# Altium schematic sheet mainSchem.SchDoc
size Tabloid
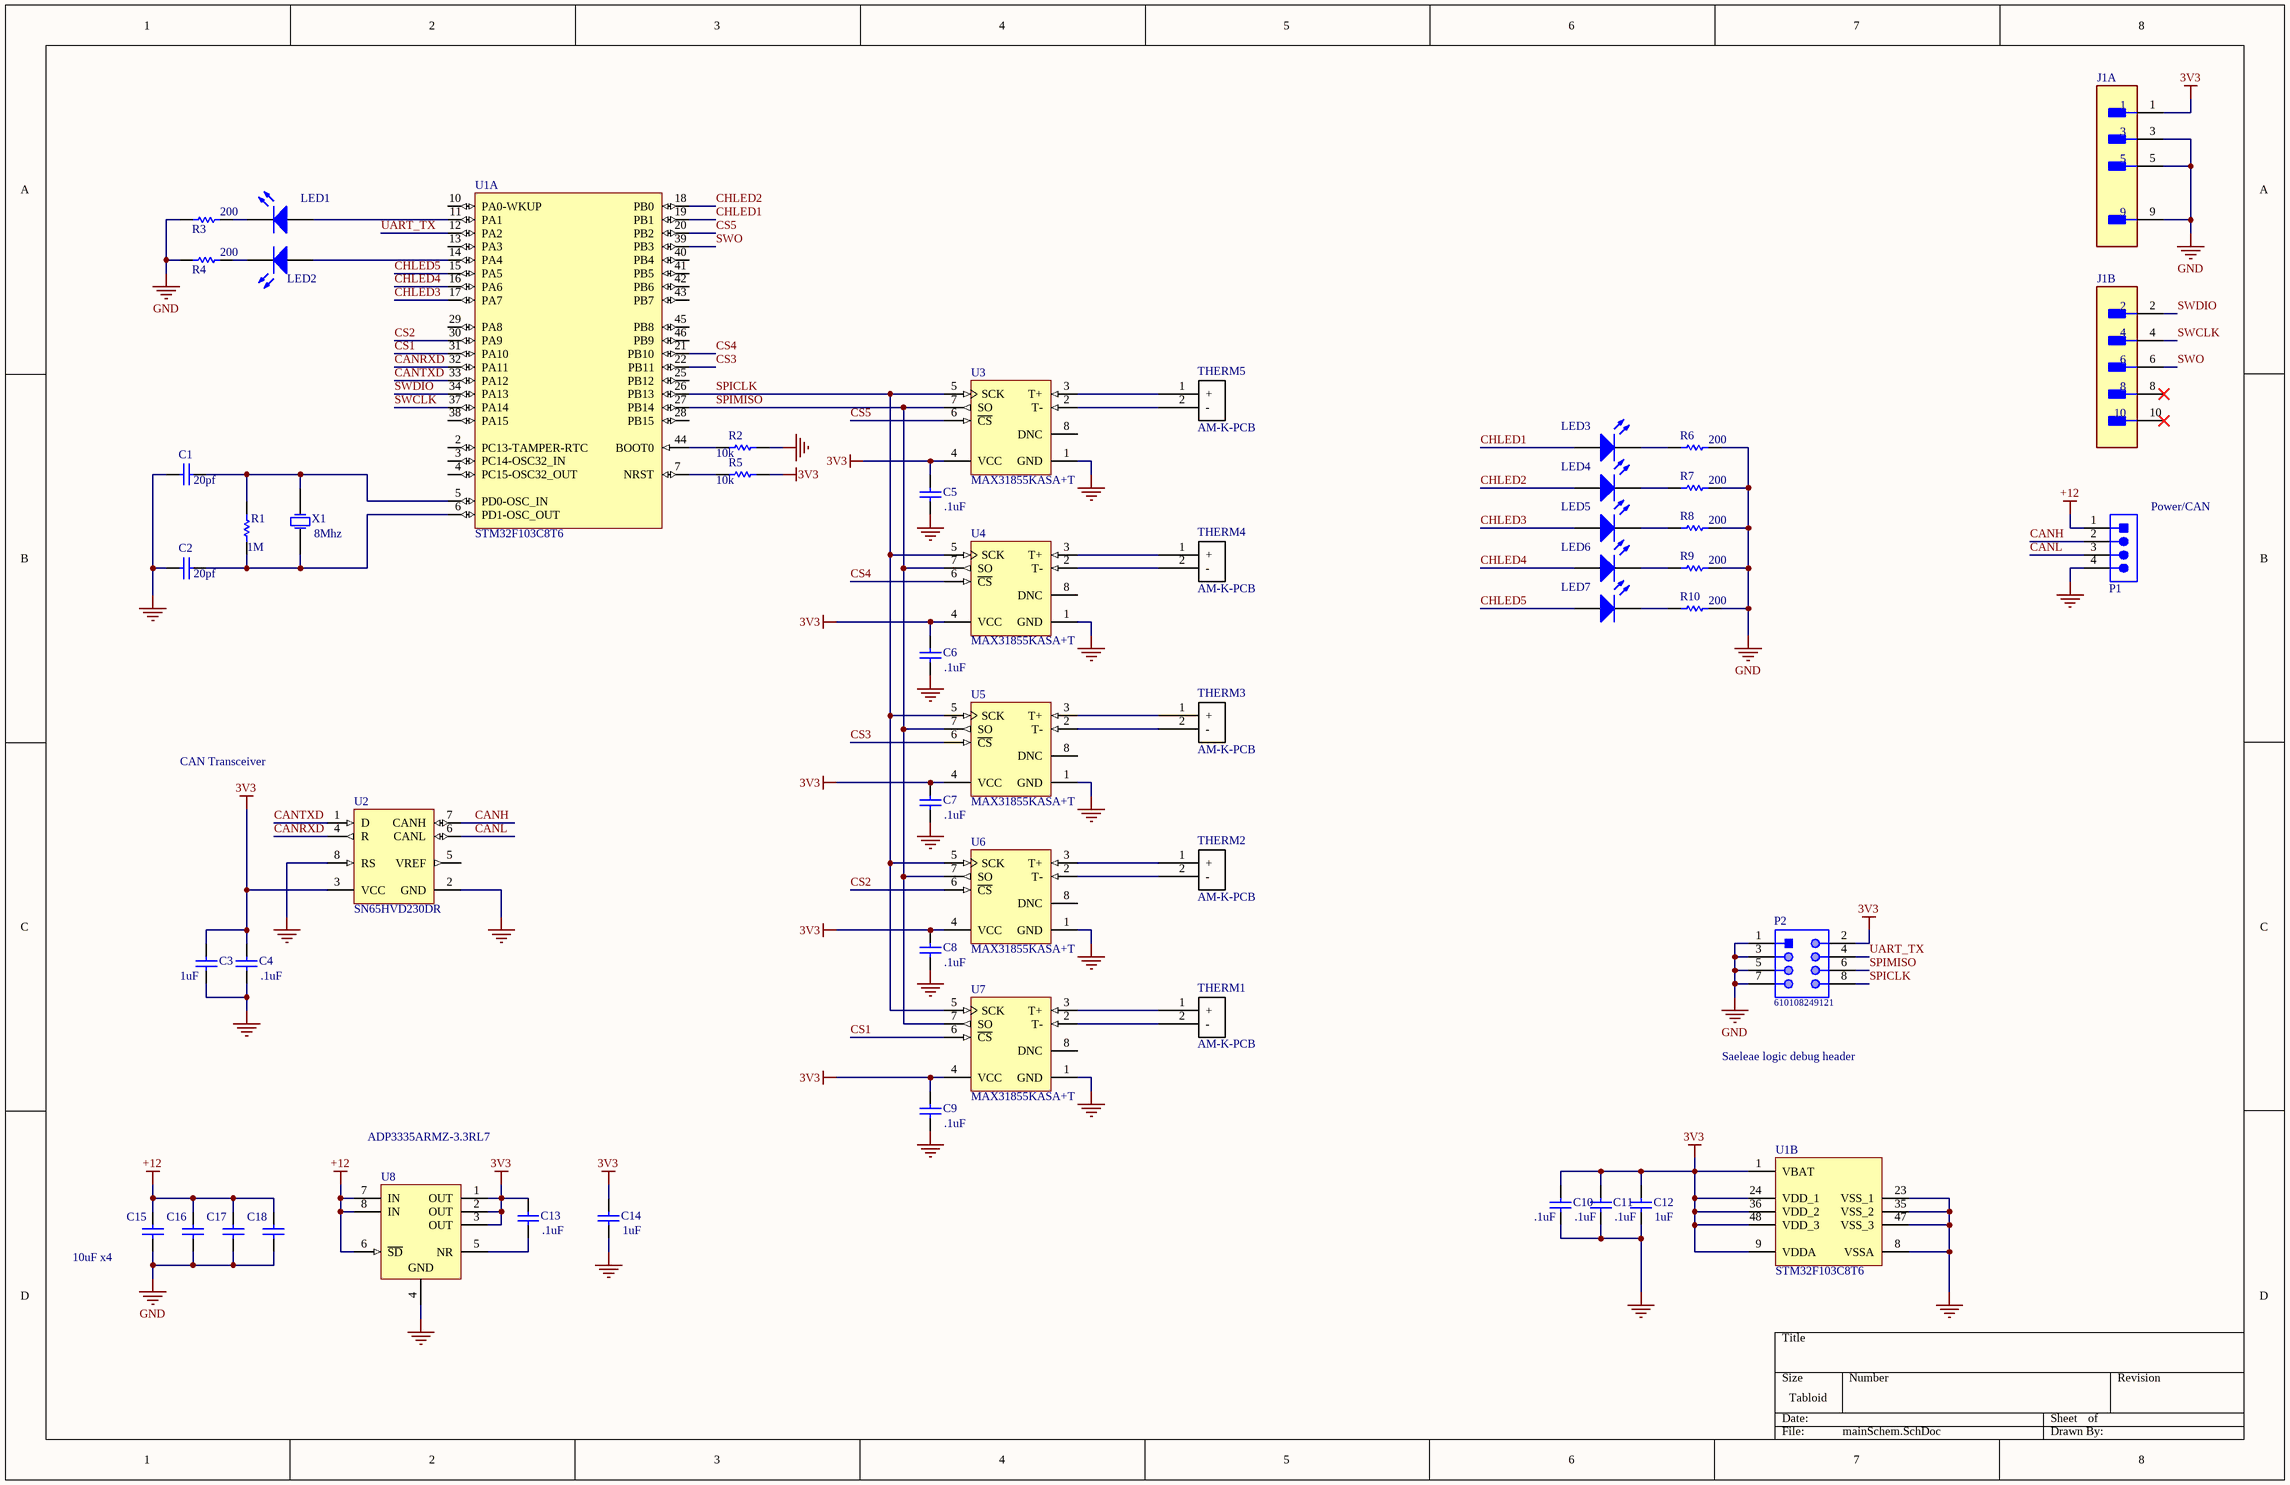
[diagram p0: mainSchem.SchDoc]

## Parts
C1  08051A200JAT2A  [CAPC2013X140X50NL20T25]  (value not drawn)
C2  08051A200JAT2A  [CAPC2013X140X50NL20T25]  (value not drawn)
C3  GRM31MR71H105KA88L  [CAPC3216X125X55LL15T25]  (value not drawn)
C4  12065C104KAT2A  [CAPC3216X94X50ML20T25]  (value not drawn)
C5  CGA3E2X7R1H104K080AA  [CAPC1608X90X20LL10]  (value not drawn)
C6  CGA3E2X7R1H104K080AA  [CAPC1608X90X20LL10]  (value not drawn)
C7  CGA3E2X7R1H104K080AA  [CAPC1608X90X20LL10]  (value not drawn)
C8  CGA3E2X7R1H104K080AA  [CAPC1608X90X20LL10]  (value not drawn)
C9  CGA3E2X7R1H104K080AA  [CAPC1608X90X20LL10]  (value not drawn)
C10  12065C104KAT2A  [CAPC3216X94X50ML20T25]  (value not drawn)
C11  12065C104KAT2A  [CAPC3216X94X50ML20T25]  (value not drawn)
C12  12065C104KAT2A  [CAPC3216X94X50ML20T25]  (value not drawn)
C13  CGA3E2X7R1H104K080AA  [CAPC1608X90X20LL10]  (value not drawn)
C14  GRM31MR71H105KA88L  [CAPC3216X125X55LL15T25]  (value not drawn)
C15  CGA5L3X5R1H106K160AB  [CAPC3216X190X20LL20]  (value not drawn)
C16  CGA5L3X5R1H106K160AB  [CAPC3216X190X20LL20]  (value not drawn)
C17  CGA5L3X5R1H106K160AB  [CAPC3216X190X20LL20]  (value not drawn)
C18  CGA5L3X5R1H106K160AB  [CAPC3216X190X20LL20]  (value not drawn)
J1  FTSH-105-01-L-DV-007-K  [FP-FTSH-105-01-L-DV-007-K-MFG]  (value not drawn)  (parts A,B of 2)
LED1  150120GS75000  [1206_A]  (value not drawn)
LED2  150120GS75000  [1206_A]  (value not drawn)
LED3  150120GS75000  [1206_A]  (value not drawn)
LED4  150120GS75000  [1206_A]  (value not drawn)
LED5  150120GS75000  [1206_A]  (value not drawn)
LED6  150120GS75000  [1206_A]  (value not drawn)
LED7  150120GS75000  [1206_A]  (value not drawn)
P1  B4B-PH-K-S(LF)(SN)  [JST-B4B-PH-K-S_V]  (value not drawn)
P2  610108249121  [610108249121]
R1  ERJ-8ENF1004V  [RESC3216X70X50NL05T20]  (value not drawn)
R2  ERJ3EKF1002V  [RESC1609X55X30LL15T15]  (value not drawn)
R3  CRCW1206200RFKEA  [RESC3216X60X45ML10T20]  (value not drawn)
R4  CRCW1206200RFKEA  [RESC3216X60X45ML10T20]  (value not drawn)
R5  ERJ3EKF1002V  [RESC1609X55X30LL15T15]  (value not drawn)
R6  CRCW0603200RFKEA  [RESC1609X50X30NL10T20]  (value not drawn)
R7  CRCW0603200RFKEA  [RESC1609X50X30NL10T20]  (value not drawn)
R8  CRCW0603200RFKEA  [RESC1609X50X30NL10T20]  (value not drawn)
R9  CRCW0603200RFKEA  [RESC1609X50X30NL10T20]  (value not drawn)
R10  CRCW0603200RFKEA  [RESC1609X50X30NL10T20]  (value not drawn)
THERM1  AM-K-PCB  [Type K Connector]
THERM2  AM-K-PCB  [Type K Connector]
THERM3  AM-K-PCB  [Type K Connector]
THERM4  AM-K-PCB  [Type K Connector]
THERM5  AM-K-PCB  [Type K Connector]
U1  STM32F103C8T6  [STM-LQFP48_L]  (parts A,B of 2)
U2  SN65HVD230DR  [D0008A_L]
U3  MAX31855KASA+T  [MAXM-S8+4_N]
U4  MAX31855KASA+T  [MAXM-S8+4_N]
U5  MAX31855KASA+T  [MAXM-S8+4_N]
U6  MAX31855KASA+T  [MAXM-S8+4_N]
U7  MAX31855KASA+T  [MAXM-S8+4_N]
U8  ADP3335ARMZ-3.3RL7  [ADI-RM-8_L]
X1  ABM3-8.000MHZ-D2Y-T  [ABRA-ABM3-2_V]  (value not drawn)

## Nets
3V3: C3.1 C4.1 C5.1 C6.1 C7.1 C8.1 C9.1 C10.1 C11.1 C12.1 C13.1 C14.1 J1.1 P2.2 R5.2 U1.1(VBAT) U1.9(VDDA) U1.24(VDD_1) U1.36(VDD_2) U1.48(VDD_3) U2.3(VCC) U3.4(VCC) U4.4(VCC) U5.4(VCC) U6.4(VCC) U7.4(VCC) U8.1(OUT) U8.2(OUT) U8.3(OUT)
+12: C15.1 C16.1 C17.1 C18.1 P1.1 U8.6(~{SD}) U8.7(IN) U8.8(IN)
GND: C1.1 C2.1 C3.2 C4.2 C5.2 C6.2 C7.2 C8.2 C9.2 C10.2 C11.2 C12.2 C14.2 C15.2 C16.2 C17.2 C18.2 J1.3 J1.5 J1.9 P1.4 P2.1 P2.3 P2.5 P2.7 R2.2 R3.1 R4.1 R6.2 R7.2 R8.2 R9.2 R10.2 U1.8(VSSA) U1.23(VSS_1) U1.35(VSS_2) U1.47(VSS_3) U2.2(GND) U2.8(RS) U3.1(GND) U4.1(GND) U5.1(GND) U6.1(GND) U7.1(GND) U8.4(GND)
CANH: P1.2 U2.7(CANH)
CANL: P1.3 U2.6(CANL)
CANRXD: U1.32(PA11) U2.4(R)
CANTXD: U1.33(PA12) U2.1(D)
CHLED1: LED3.2(A) U1.19(PB1)
CHLED2: LED4.2(A) U1.18(PB0)
CHLED3: LED5.2(A) U1.17(PA7)
CHLED4: LED6.2(A) U1.16(PA6)
CHLED5: LED7.2(A) U1.15(PA5)
CS1: U1.31(PA10) U7.6(~{CS})
CS2: U1.30(PA9) U6.6(~{CS})
CS3: U1.22(PB11) U5.6(~{CS})
CS4: U1.21(PB10) U4.6(~{CS})
CS5: U1.20(PB2) U3.6(~{CS})
SPICLK: P2.8 U1.26(PB13) U3.5(SCK) U4.5(SCK) U5.5(SCK) U6.5(SCK) U7.5(SCK)
SPIMISO: P2.6 U1.27(PB14) U3.7(SO) U4.7(SO) U5.7(SO) U6.7(SO) U7.7(SO)
SWCLK: J1.4 U1.37(PA14)
SWDIO: J1.2 U1.34(PA13)
SWO: J1.6 U1.39(PB3)
UART_TX: P2.4 U1.12(PA2)
NetC1_2: C1.2 R1.1 U1.5(PD0-OSC_IN) X1.1(X1)
NetC2_2: C2.2 R1.2 U1.6(PD1-OSC_OUT) X1.2(X2)
NetC13_2: C13.2 U8.5(NR)
NetLED1_1: LED1.1(K) R3.2
NetLED1_2: LED1.2(A) U1.11(PA1)
NetLED2_1: LED2.1(K) R4.2
NetLED2_2: LED2.2(A) U1.14(PA4)
NetLED3_1: LED3.1(K) R6.1
NetLED4_1: LED4.1(K) R7.1
NetLED5_1: LED5.1(K) R8.1
NetLED6_1: LED6.1(K) R9.1
NetLED7_1: LED7.1(K) R10.1
NetR2_1: R2.1 U1.44(BOOT0)
NetR5_1: R5.1 U1.7(NRST)
NetTHERM1_1: THERM1.1(+) U7.3(T+)
NetTHERM1_2: THERM1.2(-) U7.2(T-)
NetTHERM2_1: THERM2.1(+) U6.3(T+)
NetTHERM2_2: THERM2.2(-) U6.2(T-)
NetTHERM3_1: THERM3.1(+) U5.3(T+)
NetTHERM3_2: THERM3.2(-) U5.2(T-)
NetTHERM4_1: THERM4.1(+) U4.3(T+)
NetTHERM4_2: THERM4.2(-) U4.2(T-)
NetTHERM5_1: THERM5.1(+) U3.3(T+)
NetTHERM5_2: THERM5.2(-) U3.2(T-)

Not connected (* = marked no-connect by the designer): J1 8* 10*; U1 2(PC13-TAMPER-RTC) 3(PC14-OSC32_IN) 4(PC15-OSC32_OUT) 10(PA0-WKUP) 13(PA3) 25(PB12) 28(PB15) 29(PA8) 38(PA15) 40(PB4) 41(PB5) 42(PB6) 43(PB7) 45(PB8) 46(PB9); U2 5(VREF); U3 8(DNC); U4 8(DNC); U5 8(DNC); U6 8(DNC); U7 8(DNC)

## Notes on the sheet
- (near R3) 200
- (near R4) 200
- (near C1) 20pf
- (near R2) 10k
- (near R5) 10k
- (near R6) 200
- (near R7) 200
- (near R1) 1M
- (near X1) 8Mhz
- (near C5) .1uF
- (near R8) 200
- (near R9) 200
- (near P1) Power/CAN
- (near C2) 20pf
- (near R10) 200
- (near C6) .1uF
- CAN Transceiver
- (near C7) .1uF
- (near C8) .1uF
- (near C3) 1uF
- (near C4) .1uF
- Saeleae logic debug header
- (near C9) .1uF
- (near C13) .1uF
- (near C14) 1uF
- (near C10) .1uF
- (near C11) .1uF
- (near C12) .1uF
- (near C12) 1uF
- (near C15) 10uF x4

## Library data of the parts
C1 C2 = CMP-2007-04537-1: Manufacturer: AVX Interconnect / Elco; Part Number: 08051A200JAT2A
C3 C14 = CMP-2000-06356-1: Chip Capacitor, 1 uF, +/- 10%, 50 V, -55 to 125 degC, 1206 (3216 Metric), RoHS, Tape and Reel; Manufacturer: Murata; Case Width: 1.6mm; Dielectric: X7R; Case Length: 3.2mm; Case Height: 1.15mm; Voltage Rating DC: 50V; Capacitance: 1uF; Type: GeneralPurposeMLCC; Brand: MurataElectronics; Product: GeneralTypeMLCCs; Factory Pack Quantity: 3000; Packaging: Reel; Case Code - mm: 3216; Datasheet Version: 03/2016; Manufacturer URL: http://www.murata.com/; Tolerance: 10%; Case Code - in: 1206; Product Category: MultilayerCeramicCapacitorsMLCC-SMD/SMT; Series: GRM; Package Description: 2-Pin Surface Mount Device, Body 3.2 x 1.6 mm; Mounting Technology: SurfaceMount; Maximum Operating Temperature: +125C; RoHS: Details; Minimum Operating Temperature: -55C; Package Reference: 1206; Datasheet URL: http://search.murata.co.jp/Ceramy/image/img/A01X/G101/ENG/GRM31MR71H105KA88-01.pdf; Package / Case: 1206(3216metric); Termination Style: SMD/SMT
C4 C10-C12 = CMP-2000-05018-1: Chip Capacitor, Ceramic, 100 nF, 10%, 50 V, 1206, RoHS, Tape and Reel; Manufacturer: AVX; Rated Voltage: 50V; Dielectric: X7R; Capacitance: 100nF; Datasheet URL: http://www.mouser.com/ds/2/40/cauto-360.pdf; Manufacturer URL: http://www.avx.com/; Datasheet Version: Sep-14; Tolerance (%): ±10%; Case Size/Dimension: 1206
C5-C9 C13 = CMP-2000-07546-1: Chip Capacitor, 0.1 uF, +/- 10%, 50 V, -55 to 125 degC, 0603 (1608 Metric), RoHS, Tape and Reel; Manufacturer: TDK; Capacitance: 100nF; Voltage: 50V; Dielectric: X7R; Package Reference: 603; Radiation Hardening: No; Composition: Ceramic; Datasheet URL: https://product.tdk.com/info/en/catalog/datasheets/mlcc_automotive_general_en.pdf; Mounting Technology: SurfaceMount; Datasheet Version: 12/2014; Width: 0.8mm; Length: 1.6mm; Tolerance: 10%; Case Code (Imperial): 0603; RoHSCompliant: True; Min Operating Temperature: -55degC; Package Description: 2-Pin Surface Mount Device, Body 1.6 x 0.8 mm; Packaging: TapeandReel; Package Quantity: 1; Voltage Rating: 50V; Mount: SurfaceMount; Lead Free: LeadFree; Depth: 0.8mm; Termination: SMD/SMT; Case Code (Metric): 1608; Thickness: 0.035inch; Height: 0.8mm; Weight: 7.1E-05oz; Voltage Rating (DC): 50V; REACH SVHC: NoSVHC; Manufacturer URL: http://www.tdk.com/; Case/Package: 0603; Max Operating Temperature: 125degC
C15-C18 = CMP-2000-07597-1: Chip Capacitor, 10 uF, +/- 10%, 50 V, -55 to 85 degC, 1206 (3216 Metric), RoHS, Tape and Reel; Manufacturer: TDK; Dielectric: X5R; Voltage Rating: 50V; Capacitance: 10uF; Width: 1.6mm; Termination: SMD/SMT; Depth: 1.6mm; Package Reference: 1206; Package Quantity: 1; Lead Free: LeadFree; Max Operating Temperature: 85degC; Weight: 0.000571oz; Mounting Technology: SurfaceMount; Case Code (Imperial): 1206; Thickness: 0.063inch; Voltage Rating (DC): 50V; Case Code (Metric): 3216; RoHSCompliant: True; Packaging: TapeandReel; REACH SVHC: NoSVHC; Case/Package: 1206; Min Operating Temperature: -55degC; Manufacturer URL: http://www.tdk.com/; Datasheet Version: 01/2016; Length: 3.2mm; Radiation Hardening: No; Height: 1.6mm; Tolerance: 10%; Composition: Ceramic; Datasheet URL: https://product.tdk.com/info/en/documents/chara_sheet/CGA5L3X5R1H106K160AB.pdf; Package Description: 2-Pin Surface Mount Device, Body 3.2 x 1.6 mm; Mount: SurfaceMount
J1 = CMP-02766-000093-1: CONN HEADER SMD 10POS 1.27MM; Manufacturer: Samtec; Number Of Contacts: 9; Standoff Height: 0.2mm; Current Rating: 3.4A; Conn Orientation: Vertical; Conn Gender: Male; Device Class L3: unset; Manufacturer Part Number: FTSH-105-01-L-DV-007-K; Mouser Description: Conn Unshrouded Header HDR 10 POS 1.27mm Solder ST SMD Tube; Height: 6.38mm; RoHS: TRUE; Number Of Rows: 2; Footprint Url: http://suddendocs.samtec.com/prints/ftsh-1xx-xx-xxx-dv-xxx-footprint.pdf; Lead Free: Yes; Package: 0; Category: Conn; ComponentLink2URL: http://suddendocs.samtec.com/catalog_english/ftsh_smt.pdf; Automotive: No; ComponentLink2Description: Datasheet; Device Class L1: Connectors; Temperature: -55°C to +125°C; Digikey Description: CONN HEADER SMD 10POS 1.27MM; Device Class L2: Headers and Wire Housings; Temperature Range High: +125°C; Octopart: https://octopart.com/ftsh-105-01-l-dv-007-k-samtec-53647300; Contact Material: Gold,Nickel; Temperature Range Low: -55°C; Pitch: 1.27mm
LED1-LED7 = CMP-1426-00014-1: SMD mono-color Chip LED, WL-SMCW, Green; Manufacturer: Wuerth Elektronik; PackageReference: 1206_A; PartNumber: 150120GS75000; ComponentLink1Description: Manufacturer URL; ComponentLink2URL: http://katalog.we-online.com/led/datasheet/150120GS75000.pdf; ComponentLink2Description: Datasheet; Color: Green; ComponentLink1URL: http://www.we-online.com
P1 = CMP-2000-05165-1: Male Header, Pitch 2 mm, 1 x 4 Position, Height 6 mm, Tail Length 3.4 mm, -25 to 85 degC, RoHS, Bulk; Manufacturer: JST; No of Positions: 4; Style/Orientation: StraightHeader/Plug; Pitch: 2mm; Datasheet URL: http://datasheet.octopart.com/B4B-PH-K-S%28LF%29%28SN%29-JST-datasheet-10558886.pdf; Type: ShroudedHeader; Manufacturer URL: http://www.jst.com/home2.html; Termination: Crimp; Datasheet Version: Apr-09
P2 = CMP-1502-01147-1: SMT Angled Pin Header WR-PHD, Pitch 2.54 mm, Dual Row, 8 pins; Manufacturer: Wurth Elektronik; Pitch: 2.54mm; Working Voltage: 250VAC; Rated Current: 3A; Pin Number: 8; Gender: Male; Contact Resistance: 20mOhm; Withstanding Voltage: 600VAC; Row Number: Dual; Operating Temperature: -40to105degC; Part Number: 610108249121; Publisher: WurthElektronik; Datasheet URL: https://katalog.we-online.de/em/datasheet/6101xx249121.pdf; Package Reference: 610108249121; Manufacturer URL: http://www.we-online.de; Orientation: Angled; Mounting Technology: SMT; Packaging: TapeandReel
R1 = CMP-2003-00020-1: Manufacturer: Panasonic; Part Number: ERJ-8ENF1004V
R2 R5 = CMP-2000-07452-1: Chip Resistor, 10 KOhm, +/- 1%, 0.1 W, -55 to 155 degC, 0603 (1608 Metric), RoHS, Tape and Reel; Manufacturer: Panasonic; Voltage Rating: 75V; Case\/Package: 0603; Power Rating: 100mW; Resistance: 10KOhm; Temperature Coefficient: 100ppm\/degreesC; Number of Pins: 2; Package Reference: 603; Depth: 0.8mm; Mount: SurfaceMount; Package Description: 2-Pin Surface Mount Device, Body 1.6 x 0.85 mm; Datasheet Version: 02/2017; Length: 1.6mm; Lead Free: LeadFree; Height: 0.45mm; Number of Terminations: 2; Max Power Dissipation: 100mW; Min Operating Temperature: -55degC; Datasheet URL: https://industrial.panasonic.com/cdbs/www-data/pdf/RDA0000/AOA0000C304.pdf; Termination: SMD/SMT; Case Code (Metric): 1608; Case Code (Imperial): 0603; Tolerance: 1%; Max Operating Temperature: 155degC; RoHSCompliant: true; Voltage Rating (DC): 75V; Radiation Hardening: No; Packaging: TapeandReel; Composition: ThickFilm; Mounting Technology: SurfaceMount; Manufacturer URL: http://www.panasonic.com/; Width: 0.031inch; REACH SVHC: NoSVHC; Contact Plating: Tin; Military Standard: Not; Package Quantity: 1
R3 R4 = CMP-2003-01935-1: Manufacturer: Vishay Dale; Part Number: CRCW1206200RFKEA
R6-R10 = CMP-2000-03062-1: Manufacturer: Vishay Dale; Part Number: CRCW0603200RFKEA
THERM1-THERM5 = Type K Thermocoulple Conn.
U1 = CMP-0237-00215-3: ARM Cortex-M3 32-bit MCU, 64 KB Flash, 20 KB Internal RAM, 37 I/Os, 48-pin LQFP, -40 to 85 degC, Tray; Supply Voltage(Vcc) min (V): 2; Internal RAM Size (kB): 20; FLASH Size (Prog) (kB): 64; A/D Converter: 2x12-bit (10 Channel); I/Os (High Current): 37; Operating Frequency(F) (Processor speed) (MHz): 72; Core: ARM Cortex-M3; ComponentLink3Description: Package Specification; Mounting Technology: Surface Mount; PartNumber: STM32F103C8T6; PackageReference: LQFP48; Packing: Tray; ComponentLink3URL: http://www.st.com/st-web-ui/static/active/en/resource/technical/document/datasheet/DM00058181.pdf; DatasheetVersion: Rev. 16; ComponentLink1URL: http://www.st.com/web/en/home.html; PackageVersion: Rev. 6, 06/2013; ComponentLink2URL: http://www.st.com/st-web-ui/static/active/en/resource/technical/document/datasheet/CD00161566.pdf; ComponentLink1Description: Manufacturer URL; ComponentLink2Description: Datasheet; PackageDescription: 48-Pin Low Profile Quad Flat Package, 7 x 7 mm Body, 0.5 mm Pitch
U2 = CMP-0315-00015-2: 3.3V CAN Transceiver with Standby Mode, 17 mA, -40 to 85 degC, 8-pin SOIC (D), Green (RoHS & no Sb/Br); Manufacturer: Texas Instruments; Rating: Catalog; Transient Pulse Protection(V): -25 to 25; Receivers Per Package: 1; ICC(Max)(mA): 17; Supply Voltage(s)(V): 3.3; Low Power Mode: Standby; Mounting Technology: Surface Mount; PackageReference: D0008A; Footprint: PCA82C250; ComponentLink1URL: http://www.ti.com/general/docs/lit/getliterature.tsp?genericPartNumber=SN65HVD230&fileType=pdf; Code_JEDEC: MS-012AA; ComponentLink1Description: Datasheet; Eco-Plan: Green (RoHS & no Sb/Br); PartNumber: SN65HVD230DR; PackageDescription: 8-Pin Plastic Small Outline Integrated Circuit, 4.9 x 3.9 mm, Pitch 1.27 mm Pitch; Isolated: No; DatasheetVersion: SLOS346K; PackageVersion: revM, Jun-2011; SubFamily: CAN; Drivers Per Package: 1
U3-U7 = CMP-0253-00398-1: Cold Junction Compensated Thermocouple to Digital Converter, 14 Bits Temperature Resolution, -40 to 125 degC, 8-Pin SOIC (S8+4), Pb-Free, Tape ang Reel; Interface: SPI; Parasite Pwr.: No; Functions: Thermocouple-to-Digital Converter; ComponentLink3Description: Package Specification; DatasheetVersion: Rev. 2; Generic Part Number: MAX31855; PartNumber: MAX31855KASA+T; PackageReference: S8+4; ComponentLink3URL: http://pdfserv.maximintegrated.com/package_dwgs/21-0041.PDF; Code_JEDEC: MS-012; Packing: Tape ang Reel; PackageDescription: 8-Pin Small-Outline IC, Narrow, Body 3.9 x 4.9 mm, Pitch 1.27 mm; Mounting Technology: Surface Mount; ComponentLink1URL: http://www.maximintegrated.com/; PackageVersion: Rev. D, 10/2012; ComponentLink2URL: http://datasheets.maximintegrated.com/en/ds/MAX31855.pdf; ComponentLink1Description: Manufacturer URL; ComponentLink2Description: Datasheet
U8 = CMP-0786-00245-1: High Accuracy, Ultralow IQ, 500 mA, anyCAP Low Dropout Regulator, 2.6 to 12 V Vin, 3.3 V Vout, Industrial, 8-pin SOP (RM-8), Reel; Manufacturer: Analog Devices; Vin (max) (V): 12; Vin (min) (V): 2.6; ComponentLink4URL: Product URL:http://www.analog.com/en/ADP3335/productSearch.html; PackageDescription: 8-Pin Mini Small Outline Package, Body 3 x 3 mm, Pitch 0.65 mm; PackageVersion: Aug-05; ComponentLink1Description: Manufacturer URL; ComponentLink1URL: http://www.analog.com/en/index.html; ComponentLink3Description: Package Specification; DatasheetVersion: Rev. C; ComponentLink3URL: http://www.analog.com/static/imported-files/packages/PKG_PDF/MSOP%28RM%29/RM_8.pdf; ComponentLink2URL: http://www.analog.com/static/imported-files/data_sheets/ADP3335.pdf; ComponentLink2Description: Datasheet; ComponentLink4Description: URL Link1; PartNumber: ADP3335ARMZ-3.3RL7; PackageReference: RM-8; Packing: Reel; Code_JEDEC: MO-187-AA; Mounting Technology: Surface Mount
X1 = CMP-2000-05033-1: Miniature Ceramic Crystal, 8 MHz, -40 to 85 degC, 2-Pin SMD, RoHS, Tape and Reel; Manufacturer: ABRACON; Case Length: 5mm; Case Width: 3.2mm; Case Height: 1.3mm; Load Capacitance: 18pF; Frequency: 8MHz; Frequency Stability: 30PPM; ESR: 140Ohms; Tolerance: 20PPM; Type: MiniatureCeramicCrystal; Factory Pack Quantity: 1000; Package / Case: 5mmx3.2mm; Mounting Style: SMD/SMT; Manufacturer URL: http://www.abracon.com/; RoHS: Details; Dimensions: 3.2mmWx5mmLx1.3mmH; Datasheet URL: http://www.farnell.com/datasheets/1754353.pdf; Brand: ABRACON; Packaging: Reel; Product Category: Crystals; Package Description: 2-Pin Surface Mount Device, Body 5 x 3.2 mm; Package URL: http://www.abracon.com/Support/PackageDrawing/Resonators/ABM3.PDF; Operating Temperature Range: -40Cto+85C; Termination Style: SMD/SMT; Datasheet Version: Sep-13; Series: ABM3; Package Reference: ABM3-2